# Altium schematic sheet LEDs_Switches.SchDoc: Apalis Evaluation Board 1.1
size A3; Organization: Toradex AG; Address1: Altsagenstrasse 5; Address2: Horw; Address3: 6048; Address4: Switzerland; DocumentNumber: 30; Revision: V1.1; SheetNumber: 30; SheetTotal: 32; PageSetup: Record=PageOptions|CenterHorizontal=True|CenterVertical=True|PrintScale=0.73|XCorrection=1.00|YCorrection=1.00|PrintKind=0|BorderSize=5000000|LeftOffset=0|BottomOffset=0|Orientation=2|PaperLength=1000|PaperWidth=1000|Scale=100|PaperSource=7|PrintQuality=-4|MediaType=1|DitherType=10|PaperKind=A4|PrintScaleMode=1
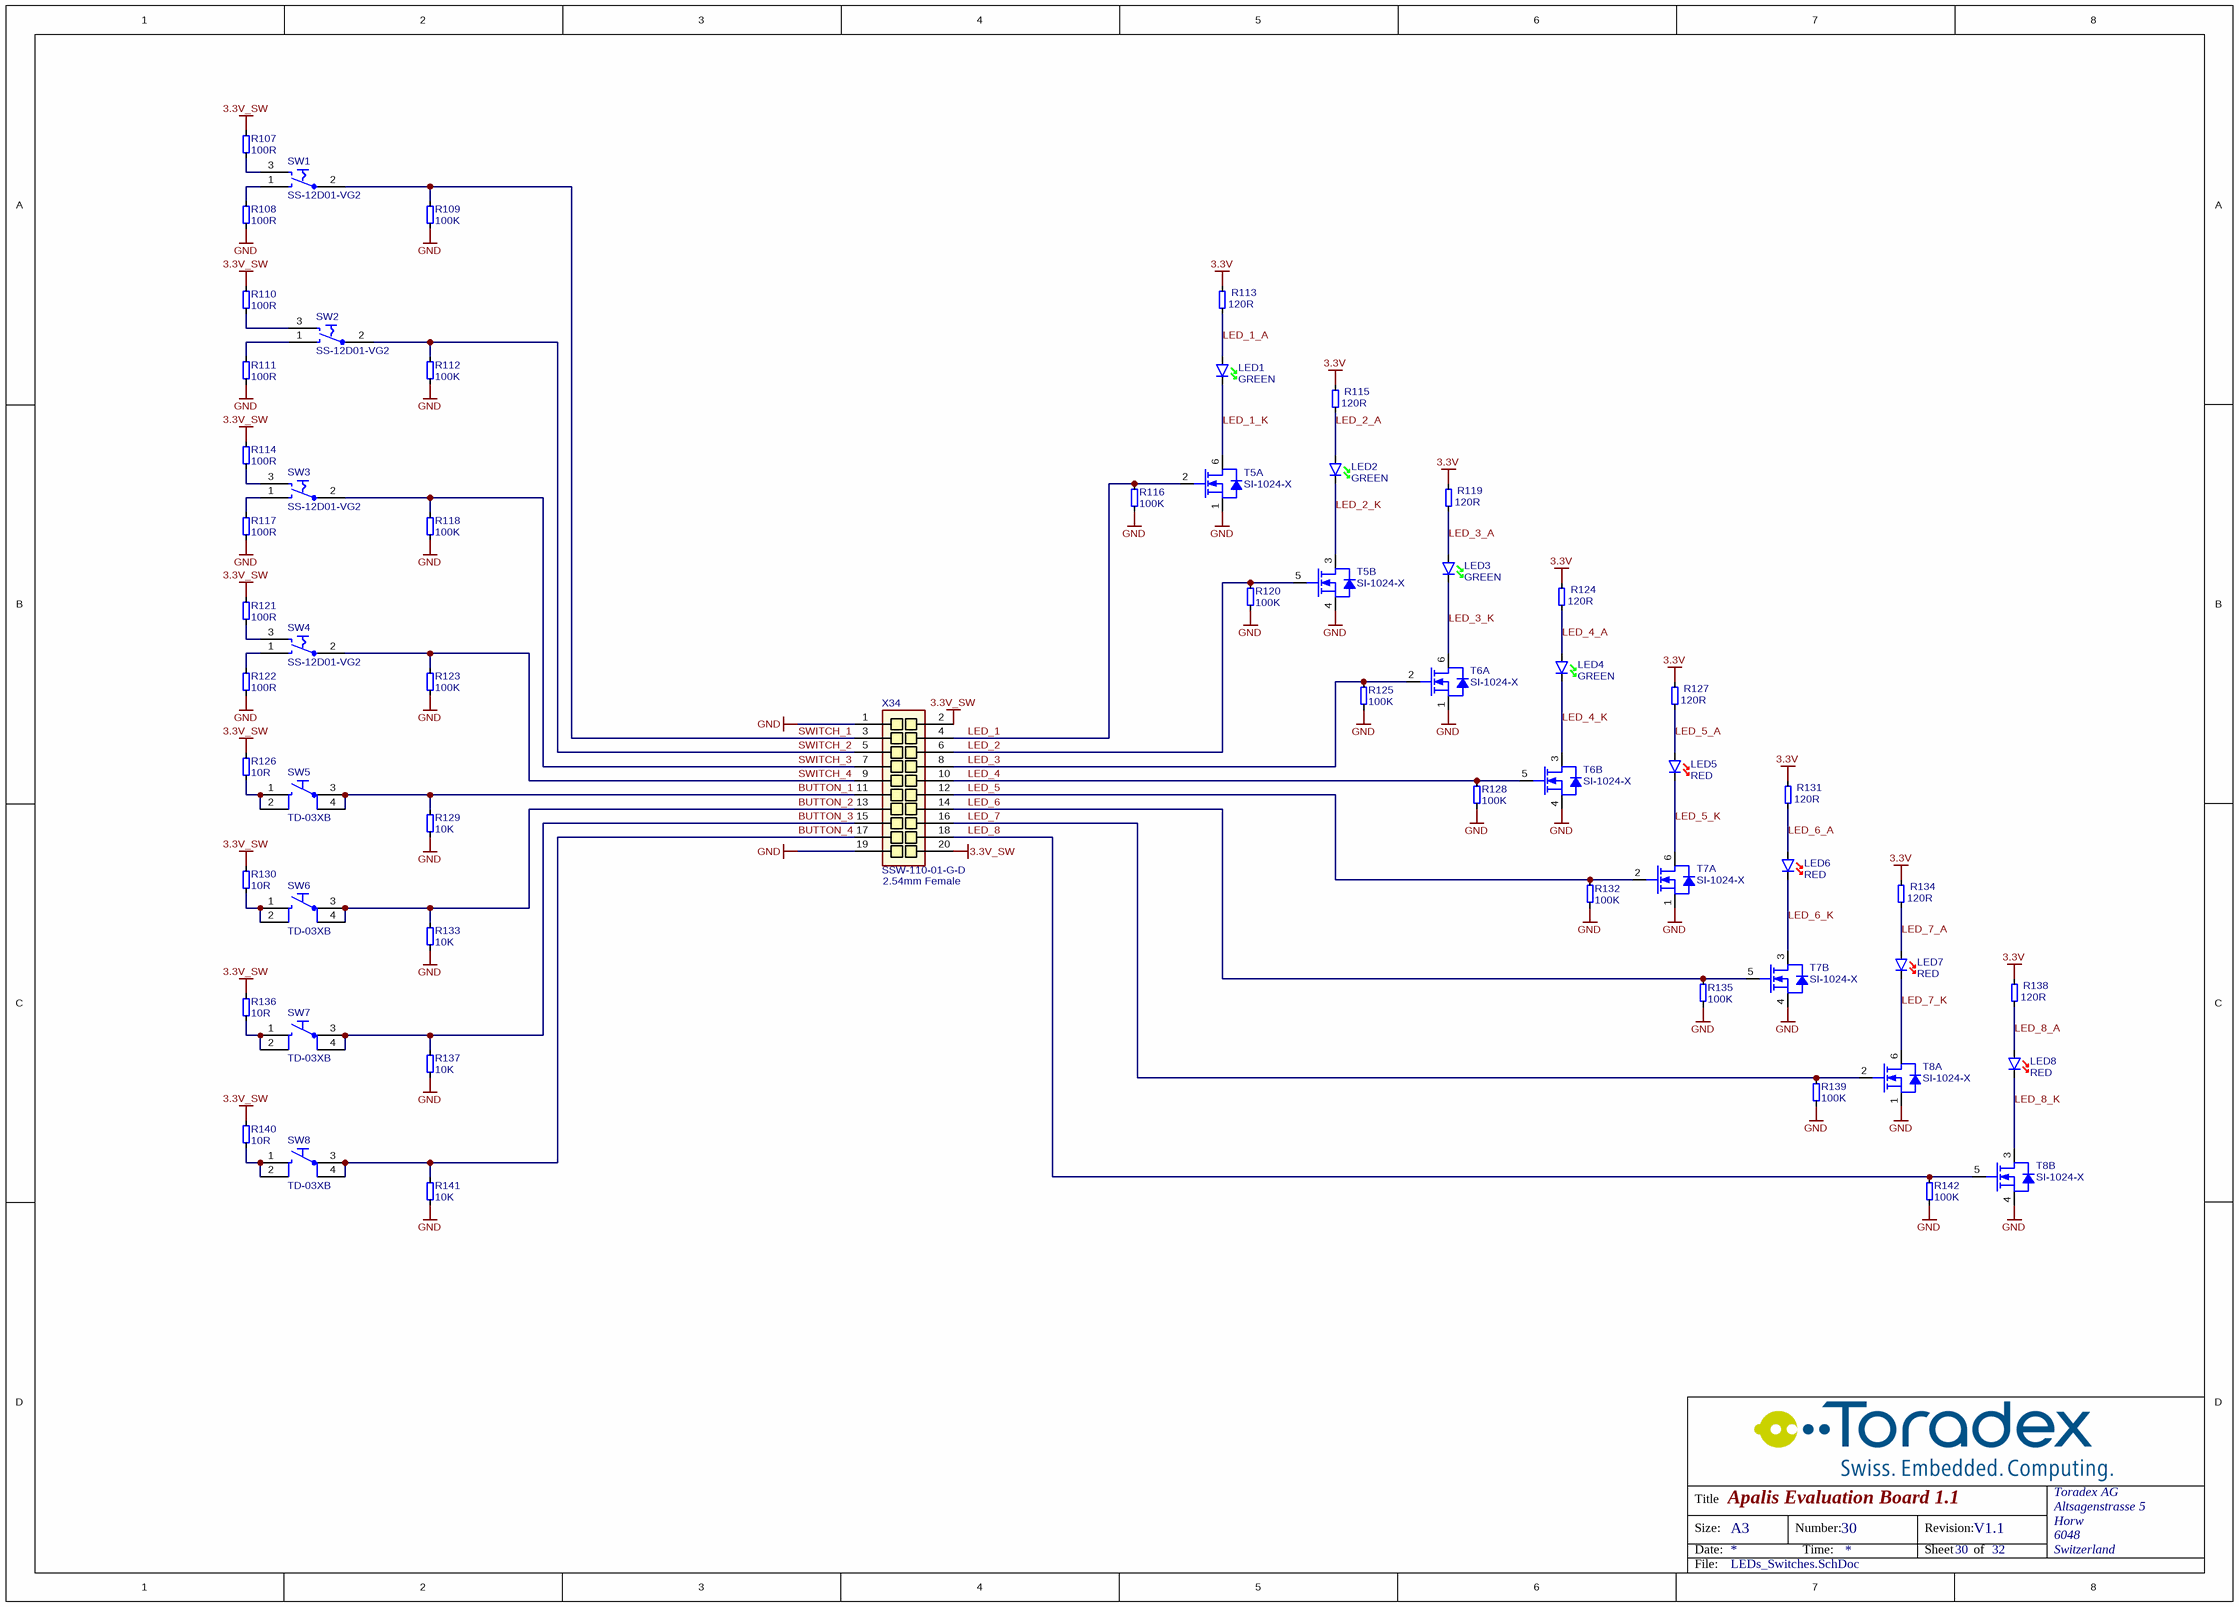
[diagram p0: LEDs_Switches.SchDoc]

## Parts
LED1  Color: GREEN  [T_Osram_T670_GREEN]  (hidden comment: LG T670-K1L2-1)
LED2  Color: GREEN  [T_Osram_T670_GREEN]  (hidden comment: LG T670-K1L2-1)
LED3  Color: GREEN  [T_Osram_T670_GREEN]  (hidden comment: LG T670-K1L2-1)
LED4  Color: GREEN  [T_Osram_T670_GREEN]  (hidden comment: LG T670-K1L2-1)
LED5  Color: RED  [T_Osram_T670_RED]  (hidden comment: LS T670-K1L2-1)
LED6  Color: RED  [T_Osram_T670_RED]  (hidden comment: LS T670-K1L2-1)
LED7  Color: RED  [T_Osram_T670_RED]  (hidden comment: LS T670-K1L2-1)
LED8  Color: RED  [T_Osram_T670_RED]  (hidden comment: LS T670-K1L2-1)
R107  100R  [T_RESC0603X30N]
R108  100R  [T_RESC0603X30N]
R109  100K  [T_RESC0603X30N]
R110  100R  [T_RESC0603X30N]
R111  100R  [T_RESC0603X30N]
R112  100K  [T_RESC0603X30N]
R113  120R  [T_RESC0603X30N]
R114  100R  [T_RESC0603X30N]
R115  120R  [T_RESC0603X30N]
R116  100K  [T_RESC0603X30N]
R117  100R  [T_RESC0603X30N]
R118  100K  [T_RESC0603X30N]
R119  120R  [T_RESC0603X30N]
R120  100K  [T_RESC0603X30N]
R121  100R  [T_RESC0603X30N]
R122  100R  [T_RESC0603X30N]
R123  100K  [T_RESC0603X30N]
R124  120R  [T_RESC0603X30N]
R125  100K  [T_RESC0603X30N]
R126  10R  [T_RESC0603X30N]
R127  120R  [T_RESC0603X30N]
R128  100K  [T_RESC0603X30N]
R129  10K  [T_RESC0603X30N]
R130  10R  [T_RESC0603X30N]
R131  120R  [T_RESC0603X30N]
R132  100K  [T_RESC0603X30N]
R133  10K  [T_RESC0603X30N]
R134  120R  [T_RESC0603X30N]
R135  100K  [T_RESC0603X30N]
R136  10R  [T_RESC0603X30N]
R137  10K  [T_RESC0603X30N]
R138  120R  [T_RESC0603X30N]
R139  100K  [T_RESC0603X30N]
R140  10R  [T_RESC0603X30N]
R141  10K  [T_RESC0603X30N]
R142  100K  [T_RESC0603X30N]
SW1  SS-12D01-VG2  [T_See-Plus_SS-12D01-VG2]
SW2  SS-12D01-VG2  [T_See-Plus_SS-12D01-VG2]
SW3  SS-12D01-VG2  [T_See-Plus_SS-12D01-VG2]
SW4  SS-12D01-VG2  [T_See-Plus_SS-12D01-VG2]
SW5  TD-03XB  [T_WMF_TD-03XB]
SW6  TD-03XB  [T_WMF_TD-03XB]
SW7  TD-03XB  [T_WMF_TD-03XB]
SW8  TD-03XB  [T_WMF_TD-03XB]
T5  Manufacturer Part No.: SI-1024-X  [SOTFL50P160X60-6N]  (hidden comment: T-Vishay-SI-1024X-N)  (parts A,B of 2)
T6  Manufacturer Part No.: SI-1024-X  [SOTFL50P160X60-6N]  (hidden comment: T-Vishay-SI-1024X-N)  (parts A,B of 2)
T7  Manufacturer Part No.: SI-1024-X  [SOTFL50P160X60-6N]  (hidden comment: T-Vishay-SI-1024X-N)  (parts A,B of 2)
T8  Manufacturer Part No.: SI-1024-X  [SOTFL50P160X60-6N]  (hidden comment: T-Vishay-SI-1024X-N)  (parts A,B of 2)
X34  SSW-110-01-G-D  [T_Samtec_SSW-110-01-G-D]

## Nets
3.3V: R113.2 R115.2 R119.2 R124.2 R127.2 R131.2 R134.2 R138.2
3.3V_SW: R107.2 R110.2 R114.2 R121.2 R126.2 R130.2 R136.2 R140.2 X34.2 X34.20
GND: R108.1 R109.1 R111.1 R112.1 R116.1 R117.1 R118.1 R120.1 R122.1 R123.1 R125.1 R128.1 R129.1 R132.1 R133.1 R135.1 R137.1 R139.1 R141.1 R142.1 T5.1(S) T5.4(S) T6.1(S) T6.4(S) T7.1(S) T7.4(S) T8.1(S) T8.4(S) X34.1 X34.19
BUTTON_1: R129.2 SW5.3 SW5.4 X34.11
BUTTON_2: R133.2 SW6.3 SW6.4 X34.13
BUTTON_3: R137.2 SW7.3 SW7.4 X34.15
BUTTON_4: R141.2 SW8.3 SW8.4 X34.17
LED_1: R116.2 T5.2(G) X34.4
LED_1_A: LED1.A R113.1
LED_1_K: LED1.K T5.6(D)
LED_2: R120.2 T5.5(G) X34.6
LED_2_A: LED2.A R115.1
LED_2_K: LED2.K T5.3(D)
LED_3: R125.2 T6.2(G) X34.8
LED_3_A: LED3.A R119.1
LED_3_K: LED3.K T6.6(D)
LED_4: R128.2 T6.5(G) X34.10
LED_4_A: LED4.A R124.1
LED_4_K: LED4.K T6.3(D)
LED_5: R132.2 T7.2(G) X34.12
LED_5_A: LED5.A R127.1
LED_5_K: LED5.K T7.6(D)
LED_6: R135.2 T7.5(G) X34.14
LED_6_A: LED6.A R131.1
LED_6_K: LED6.K T7.3(D)
LED_7: R139.2 T8.2(G) X34.16
LED_7_A: LED7.A R134.1
LED_7_K: LED7.K T8.6(D)
LED_8: R142.2 T8.5(G) X34.18
LED_8_A: LED8.A R138.1
LED_8_K: LED8.K T8.3(D)
SWITCH_1: R109.2 SW1.2 X34.3
SWITCH_2: R112.2 SW2.2 X34.5
SWITCH_3: R118.2 SW3.2 X34.7
SWITCH_4: R123.2 SW4.2 X34.9
NetR107_1: R107.1 SW1.3
NetR108_2: R108.2 SW1.1
NetR110_1: R110.1 SW2.3
NetR111_2: R111.2 SW2.1
NetR114_1: R114.1 SW3.3
NetR117_2: R117.2 SW3.1
NetR121_1: R121.1 SW4.3
NetR122_2: R122.2 SW4.1
NetR126_1: R126.1 SW5.1 SW5.2
NetR130_1: R130.1 SW6.1 SW6.2
NetR136_1: R136.1 SW7.1 SW7.2
NetR140_1: R140.1 SW8.1 SW8.2

## Notes on the sheet
- (near X34) 2.54mm Female
- Title
- Size:
- Date:
- A3
- Number:
- Time:
- Revision:
- Sheet
- of
- File:

## Library data of the parts
LED1-LED4 = LED-Osram-T670-K1L2-1: LED green Osram LG T670-K1L2-1; Manufacturer Name: Osram; Manufacturer Part No.: LG T670-K1L2-1
LED5-LED8 = LED-Osram-LS T670-K1L2-1: LED red, Osram LS T670-K1L2-1; Manufacturer Name: Osram; Manufacturer Part No.: LS T670-K1L2-1
R107 R108 R110 R111 R114 R117 R121 R122 = R-100R-63mW-5%-0603: Resistor 100 ohm 63mW 5% 0603; Rating: 63mW; Tolerance: 5%; Value: 100R
R109 R112 R116 R118 R120 R123 R125 R128 R132 R135 R139 R142 = R-100KR-63mW-5%-0603: Resistor 100 Kohm 63mW 5% 0603; Value: 100KR; Rating: 63mW; Tolerance: 5%
R113 R115 R119 R124 R127 R131 R134 R138 = R-120R-63mW-5%-0603: Resistor 120 ohm 63mW 5% 0603; Rating: 63mW; Tolerance: 5%; Value: 120R
R126 R130 R136 R140 = R-10R-63mW-5%-0603: Resistor 10 ohm 63mW 5% 0603; Rating: 63mW; Tolerance: 5%; Value: 10R
R129 R133 R137 R141 = R-10KR-63mW-5%-0603: Resistor 10 Kohm 63mW 5% 0603; Value: 10KR; Rating: 63mW; Tolerance: 5%
SW1-SW4 = SW-See-Plus-SS-12D01-VG2: Switch; Rating: 0.3A; Manufacturer Name: See-Plus; Manufacturer Part No.: SS-12D01-VG2
SW5-SW8 = SW-WMF-TD-03XB: Push Button; Manufacturer Name: WMF; Rating: 50mA; Manufacturer Part No.: TD-03XB
T5-T8 = T-Vishay-SI-1024X-N: Dual N-Channel 20V (D-S)  MOSFET; Manufacturer Name: Vishay
X34 = CON-Samtec-SSW-110-01-G-D: Receptacle Female Socket 2x10 Pins, 2.54 mm pitch; Manufacturer Name: Samtec; Pitch: 2.54mm; No. of wasy: 2x10; Manufacturer Part No.: SSW-110-01-G-D